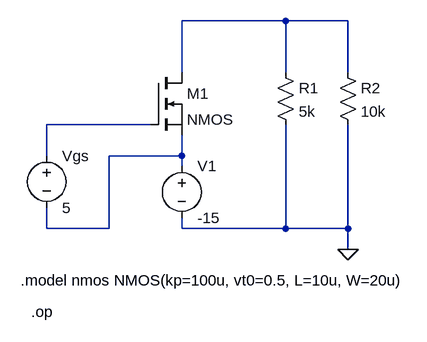
[diagram p0: schematic TASK1.asc]
TASK1.asc, the LTspice schematic file:
Version 4
SHEET 1 880 680
WIRE 384 16 224 16
WIRE 480 16 384 16
WIRE 224 96 224 16
WIRE 384 96 384 16
WIRE 480 96 480 16
WIRE 176 176 16 176
WIRE 16 224 16 176
WIRE 224 224 224 192
WIRE 224 224 112 224
WIRE 224 240 224 224
WIRE 16 336 16 304
WIRE 112 336 112 224
WIRE 112 336 16 336
WIRE 224 336 224 320
WIRE 384 336 384 176
WIRE 384 336 224 336
WIRE 480 336 480 176
WIRE 480 336 384 336
WIRE 480 368 480 336
FLAG 480 368 0
SYMBOL nmos 176 96 R0
SYMATTR InstName M1
SYMBOL voltage 16 208 R0
SYMATTR InstName Vgs
SYMATTR Value 5
SYMBOL voltage 224 224 R0
WINDOW 123 0 0 Left 0
WINDOW 39 0 0 Left 0
SYMATTR InstName V1
SYMATTR Value -15
SYMBOL res 368 80 R0
SYMATTR InstName R1
SYMATTR Value 5k
SYMBOL res 464 80 R0
SYMATTR InstName R2
SYMATTR Value 10k
TEXT -24 416 Left 2 !.model nmos NMOS(kp=100u, vt0=0.5, L=10u, W=20u)
TEXT -8 464 Left 2 !.op

The netlist it stands for:
* TASK1.asc
M1 N001 N002 N003 N003 NMOS
Vgs N002 N003 5
V1 N003 0 -15
R1 N001 0 5k
R2 N001 0 10k
.model NMOS NMOS
.model PMOS PMOS
.lib standard.mos
.model nmos NMOS(kp=100u, vt0=0.5, L=10u, W=20u)
.op
.backanno
.end